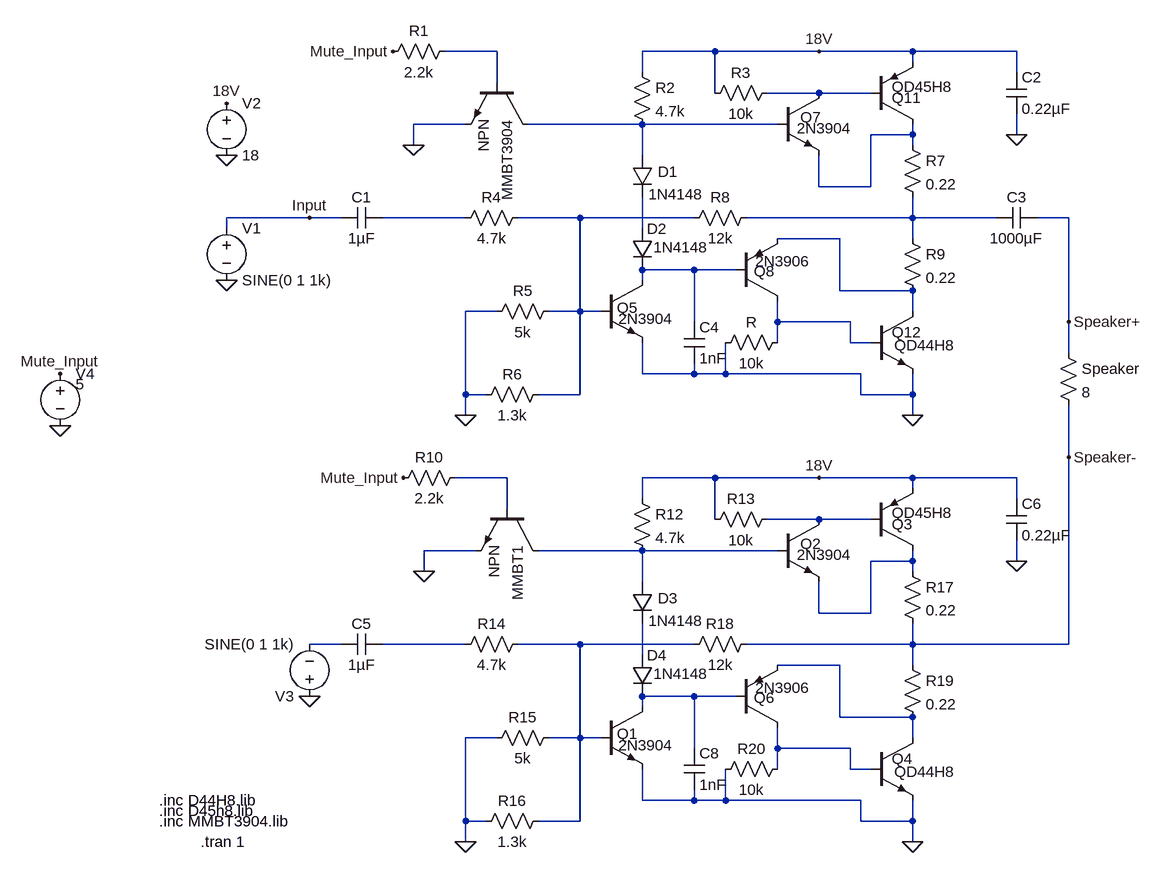
[diagram p0: schematic Dorr_full_with_mute.asc]
Dorr_full_with_mute.asc, the LTspice schematic file:
Version 4
SHEET 1 1772 2552
WIRE -32 -64 -112 -64
WIRE 304 -64 192 -64
WIRE 464 -64 304 -64
WIRE 608 -64 464 -64
WIRE 768 -64 608 -64
WIRE 608 -48 608 -64
WIRE 192 -32 192 -64
WIRE 768 -32 768 -64
WIRE -32 -16 -32 -64
WIRE 304 0 304 -64
WIRE 464 0 384 0
WIRE 544 0 464 0
WIRE -80 48 -160 48
WIRE 192 48 16 48
WIRE 400 48 192 48
WIRE 608 64 608 48
WIRE 608 64 544 64
WIRE 768 64 768 32
WIRE -160 80 -160 48
WIRE 608 80 608 64
WIRE 192 96 192 48
WIRE 464 144 464 96
WIRE 544 144 544 64
WIRE 544 144 464 144
WIRE -320 192 -448 192
WIRE -272 192 -320 192
WIRE -80 192 -208 192
WIRE 96 192 0 192
WIRE 272 192 96 192
WIRE 608 192 608 160
WIRE 608 192 352 192
WIRE 736 192 608 192
WIRE 848 192 800 192
WIRE -448 208 -448 192
WIRE 192 208 192 160
WIRE 496 224 400 224
WIRE 608 224 608 192
WIRE 272 272 192 272
WIRE 336 272 272 272
WIRE 192 288 192 272
WIRE 496 304 496 224
WIRE 608 304 496 304
WIRE -32 336 -80 336
WIRE 96 336 96 192
WIRE 96 336 48 336
WIRE 128 336 96 336
WIRE 608 336 608 304
WIRE 272 352 272 272
WIRE 400 352 400 320
WIRE 512 352 400 352
WIRE 848 352 848 192
WIRE 400 384 400 352
WIRE 512 384 512 352
WIRE 544 384 512 384
WIRE 848 400 848 352
WIRE 192 432 192 384
WIRE 272 432 272 416
WIRE 272 432 192 432
WIRE 320 432 320 384
WIRE 320 432 272 432
WIRE 528 432 320 432
WIRE -80 464 -80 336
WIRE -48 464 -80 464
WIRE 96 464 96 336
WIRE 96 464 32 464
WIRE 528 464 528 432
WIRE 608 464 608 432
WIRE 608 464 528 464
WIRE -80 496 -80 464
WIRE 608 496 608 464
WIRE 848 560 848 480
WIRE -16 592 -96 592
WIRE 304 592 192 592
WIRE 464 592 304 592
WIRE 608 592 464 592
WIRE 768 592 608 592
WIRE 608 608 608 592
WIRE 192 624 192 592
WIRE 768 624 768 592
WIRE -16 640 -16 592
WIRE 304 656 304 592
WIRE 464 656 384 656
WIRE 544 656 464 656
WIRE -64 704 -144 704
WIRE 192 704 32 704
WIRE 400 704 192 704
WIRE 608 720 608 704
WIRE 608 720 544 720
WIRE 768 720 768 688
WIRE -144 736 -144 704
WIRE 608 736 608 720
WIRE 192 752 192 704
WIRE 464 800 464 752
WIRE 544 800 544 720
WIRE 544 800 464 800
WIRE -272 848 -320 848
WIRE -80 848 -208 848
WIRE 96 848 0 848
WIRE 272 848 96 848
WIRE 608 848 608 816
WIRE 608 848 352 848
WIRE 848 848 848 560
WIRE 848 848 608 848
WIRE 192 864 192 816
WIRE 496 880 400 880
WIRE 608 880 608 848
WIRE 272 928 192 928
WIRE 336 928 272 928
WIRE 192 944 192 928
WIRE 496 960 496 880
WIRE 608 960 496 960
WIRE -32 992 -80 992
WIRE 96 992 96 848
WIRE 96 992 48 992
WIRE 128 992 96 992
WIRE 608 992 608 960
WIRE 272 1008 272 928
WIRE 400 1008 400 976
WIRE 512 1008 400 1008
WIRE 400 1040 400 1008
WIRE 512 1040 512 1008
WIRE 544 1040 512 1040
WIRE 192 1088 192 1040
WIRE 272 1088 272 1072
WIRE 272 1088 192 1088
WIRE 320 1088 320 1040
WIRE 320 1088 272 1088
WIRE 528 1088 320 1088
WIRE -80 1120 -80 992
WIRE -48 1120 -80 1120
WIRE 96 1120 96 992
WIRE 96 1120 32 1120
WIRE 528 1120 528 1088
WIRE 608 1120 608 1088
WIRE 608 1120 528 1120
WIRE -80 1152 -80 1120
WIRE 608 1152 608 1120
FLAG -160 80 0
FLAG -80 496 0
FLAG 768 64 0
FLAG 608 496 0
FLAG 848 352 Speaker+
FLAG -320 192 Input
FLAG -192 -64 Mute_Input
FLAG -448 288 0
FLAG -448 96 0
FLAG -448 16 18V
FLAG 464 -64 18V
FLAG -80 1152 0
FLAG 768 720 0
FLAG 608 1152 0
FLAG 464 592 18V
FLAG -320 928 0
FLAG 848 560 Speaker-
FLAG -704 512 0
FLAG -704 432 Mute_Input
FLAG -144 736 0
FLAG -176 592 Mute_Input
DATAFLAG 96 192 ""
DATAFLAG 608 192 ""
DATAFLAG 608 64 ""
DATAFLAG 96 848 ""
DATAFLAG 608 848 ""
DATAFLAG 608 720 ""
SYMBOL res -96 -80 R90
WINDOW 0 0 56 VBottom 2
WINDOW 3 32 56 VTop 2
SYMATTR InstName R1
SYMATTR Value 2.2k
SYMBOL res 176 -48 R0
SYMATTR InstName R2
SYMATTR Value 4.7k
SYMBOL res 400 -16 R90
WINDOW 0 0 56 VBottom 2
WINDOW 3 32 56 VTop 2
SYMATTR InstName R3
SYMATTR Value 10k
SYMBOL res -96 208 R270
WINDOW 0 32 56 VTop 2
WINDOW 3 0 56 VBottom 2
SYMATTR InstName R4
SYMATTR Value 4.7k
SYMBOL cap -272 208 R270
WINDOW 0 32 32 VTop 2
WINDOW 3 0 32 VBottom 2
SYMATTR InstName C1
SYMATTR Value 1µF
SYMBOL res 64 320 R90
WINDOW 0 0 56 VBottom 2
WINDOW 3 32 56 VTop 2
SYMATTR InstName R5
SYMATTR Value 5k
SYMBOL res 48 448 R90
WINDOW 0 0 56 VBottom 2
WINDOW 3 32 56 VTop 2
SYMATTR InstName R6
SYMATTR Value 1.3k
SYMBOL npn2 128 288 R0
WINDOW 0 25 42 Left 2
WINDOW 3 27 59 Left 2
SYMATTR InstName Q5
SYMATTR Value 2N3904
SYMBOL diode 176 96 R0
WINDOW 0 40 25 Left 2
WINDOW 3 25 60 Left 2
SYMATTR InstName D1
SYMATTR Value 1N4148
SYMBOL npn2 400 0 R0
WINDOW 0 35 37 Left 2
WINDOW 3 30 54 Left 2
SYMATTR InstName Q7
SYMATTR Value 2N3904
SYMBOL pnp2 544 48 M180
WINDOW 0 32 41 Left 2
WINDOW 3 32 58 Left 2
SYMATTR InstName Q11
SYMATTR Value QD45H8
SYMBOL cap 752 -32 R0
SYMATTR InstName C2
SYMATTR Value 0.22µF
SYMBOL res 592 64 R0
SYMATTR InstName R7
SYMATTR Value 0.22
SYMBOL res 256 208 R270
WINDOW 0 32 56 VTop 2
WINDOW 3 0 56 VBottom 2
SYMATTR InstName R8
SYMATTR Value 12k
SYMBOL diode 176 208 R0
WINDOW 0 23 1 Left 2
WINDOW 3 33 29 Left 2
SYMATTR InstName D2
SYMATTR Value 1N4148
SYMBOL res 592 208 R0
SYMATTR InstName R9
SYMATTR Value 0.22
SYMBOL cap 736 208 R270
WINDOW 0 32 32 VTop 2
WINDOW 3 0 32 VBottom 2
SYMATTR InstName C3
SYMATTR Value 1000µF
SYMBOL npn2 544 336 R0
WINDOW 0 32 32 Left 2
WINDOW 3 36 52 Left 2
SYMATTR InstName Q12
SYMATTR Value QD44H8
SYMBOL cap 256 352 R0
SYMATTR InstName C4
SYMATTR Value 1nF
SYMBOL pnp2 336 320 M180
WINDOW 0 28 46 Left 2
WINDOW 3 30 61 Left 2
SYMATTR InstName Q8
SYMATTR Value 2N3906
SYMBOL res 416 368 R90
WINDOW 0 0 56 VBottom 2
WINDOW 3 32 56 VTop 2
SYMATTR InstName R
SYMATTR Value 10k
SYMBOL voltage -448 192 R0
WINDOW 123 0 0 Left 0
WINDOW 39 0 0 Left 0
SYMATTR InstName V1
SYMATTR Value SINE(0 1 1k)
SYMBOL voltage -448 0 R0
WINDOW 123 0 0 Left 0
WINDOW 39 0 0 Left 0
SYMATTR InstName V2
SYMATTR Value 18
SYMBOL res 832 384 R0
SYMATTR InstName Speaker
SYMATTR Value 8
SYMBOL res 176 608 R0
SYMATTR InstName R12
SYMATTR Value 4.7k
SYMBOL res 400 640 R90
WINDOW 0 0 56 VBottom 2
WINDOW 3 32 56 VTop 2
SYMATTR InstName R13
SYMATTR Value 10k
SYMBOL res -96 864 R270
WINDOW 0 32 56 VTop 2
WINDOW 3 0 56 VBottom 2
SYMATTR InstName R14
SYMATTR Value 4.7k
SYMBOL cap -272 864 R270
WINDOW 0 32 32 VTop 2
WINDOW 3 0 32 VBottom 2
SYMATTR InstName C5
SYMATTR Value 1µF
SYMBOL res 64 976 R90
WINDOW 0 0 56 VBottom 2
WINDOW 3 32 56 VTop 2
SYMATTR InstName R15
SYMATTR Value 5k
SYMBOL res 48 1104 R90
WINDOW 0 0 56 VBottom 2
WINDOW 3 32 56 VTop 2
SYMATTR InstName R16
SYMATTR Value 1.3k
SYMBOL npn2 128 944 R0
WINDOW 0 25 42 Left 2
WINDOW 3 27 59 Left 2
SYMATTR InstName Q1
SYMATTR Value 2N3904
SYMBOL diode 176 752 R0
WINDOW 0 40 25 Left 2
WINDOW 3 25 60 Left 2
SYMATTR InstName D3
SYMATTR Value 1N4148
SYMBOL npn2 400 656 R0
WINDOW 0 35 37 Left 2
WINDOW 3 30 54 Left 2
SYMATTR InstName Q2
SYMATTR Value 2N3904
SYMBOL pnp2 544 704 M180
WINDOW 0 32 41 Left 2
WINDOW 3 32 58 Left 2
SYMATTR InstName Q3
SYMATTR Value QD45H8
SYMBOL cap 752 624 R0
SYMATTR InstName C6
SYMATTR Value 0.22µF
SYMBOL res 592 720 R0
SYMATTR InstName R17
SYMATTR Value 0.22
SYMBOL res 256 864 R270
WINDOW 0 32 56 VTop 2
WINDOW 3 0 56 VBottom 2
SYMATTR InstName R18
SYMATTR Value 12k
SYMBOL diode 176 864 R0
WINDOW 0 23 1 Left 2
WINDOW 3 33 29 Left 2
SYMATTR InstName D4
SYMATTR Value 1N4148
SYMBOL res 592 864 R0
SYMATTR InstName R19
SYMATTR Value 0.22
SYMBOL npn2 544 992 R0
WINDOW 0 32 32 Left 2
WINDOW 3 36 52 Left 2
SYMATTR InstName Q4
SYMATTR Value QD44H8
SYMBOL cap 256 1008 R0
SYMATTR InstName C8
SYMATTR Value 1nF
SYMBOL pnp2 336 976 M180
WINDOW 0 28 46 Left 2
WINDOW 3 30 61 Left 2
SYMATTR InstName Q6
SYMATTR Value 2N3906
SYMBOL res 416 1024 R90
WINDOW 0 0 56 VBottom 2
WINDOW 3 32 56 VTop 2
SYMATTR InstName R20
SYMATTR Value 10k
SYMBOL voltage -320 944 R180
WINDOW 123 0 0 Left 0
WINDOW 39 0 0 Left 0
SYMATTR InstName V3
SYMATTR Value SINE(0 1 1k)
SYMBOL npn2 16 -16 R90
SYMATTR InstName MMBT3904
SYMBOL voltage -704 416 R0
WINDOW 3 24 32 Left 2
WINDOW 123 0 0 Left 0
WINDOW 39 0 0 Left 0
SYMATTR InstName V4
SYMATTR Value 5
SYMBOL res -80 576 R90
WINDOW 0 0 56 VBottom 2
WINDOW 3 32 56 VTop 2
SYMATTR InstName R10
SYMATTR Value 2.2k
SYMBOL npn2 32 640 R90
SYMATTR InstName MMBT1
TEXT -488 1152 Left 2 !.tran 1
TEXT -552 1120 Left 2 !.inc MMBT3904.lib
TEXT -552 1104 Left 2 !.inc D45h8.lib
TEXT -552 1088 Left 2 !.inc D44H8.lib

The netlist it stands for:
* Dorr_full_with_mute.asc
R1 N001 Mute_Input 2.2k
R2 18V N003 4.7k
R3 N002 18V 10k
R4 N005 N006 4.7k
C1 Input N005 1µF
R5 N006 0 5k
R6 N006 0 1.3k
Q5 N010 N006 0 0 2N3904
D1 N003 N008 1N4148
Q7 N002 N003 N004 0 2N3904
Q11 N004 N002 18V 0 QD45H8
C2 18V 0 0.22µF
R7 N004 N007 0.22
R8 N006 N007 12k
D2 N008 N010 1N4148
R9 N007 N009 0.22
C3 N007 Speaker+ 1000µF
Q12 N009 N011 0 0 QD44H8
C4 N010 0 1nF
Q8 N011 N010 N009 0 2N3906
R N011 0 10k
V1 Input 0 SINE(0 1 1k)
V2 18V 0 18
R§Speaker Speaker+ Speaker- 8
R12 18V N014 4.7k
R13 N013 18V 10k
R14 N017 N018 4.7k
C5 N016 N017 1µF
R15 N018 0 5k
R16 N018 0 1.3k
Q1 N021 N018 0 0 2N3904
D3 N014 N019 1N4148
Q2 N013 N014 N015 0 2N3904
Q3 N015 N013 18V 0 QD45H8
C6 18V 0 0.22µF
R17 N015 Speaker- 0.22
R18 N018 Speaker- 12k
D4 N019 N021 1N4148
R19 Speaker- N020 0.22
Q4 N020 N022 0 0 QD44H8
C8 N021 0 1nF
Q6 N022 N021 N020 0 2N3906
R20 N022 0 10k
V3 0 N016 SINE(0 1 1k)
Q§MMBT3904 N003 N001 0 0 NPN
V4 Mute_Input 0 5
R10 N012 Mute_Input 2.2k
Q§MMBT1 N014 N012 0 0 NPN
.model D D
.lib standard.dio
.model NPN NPN
.model PNP PNP
.lib standard.bjt
.tran 1
.inc MMBT3904.lib
.inc D45h8.lib
.inc D44H8.lib
.backanno
.end